# EAGLE design persephone_A_v1 (EAGLE 9.6.2)

## Sheet 1 of 2: Peak indicator
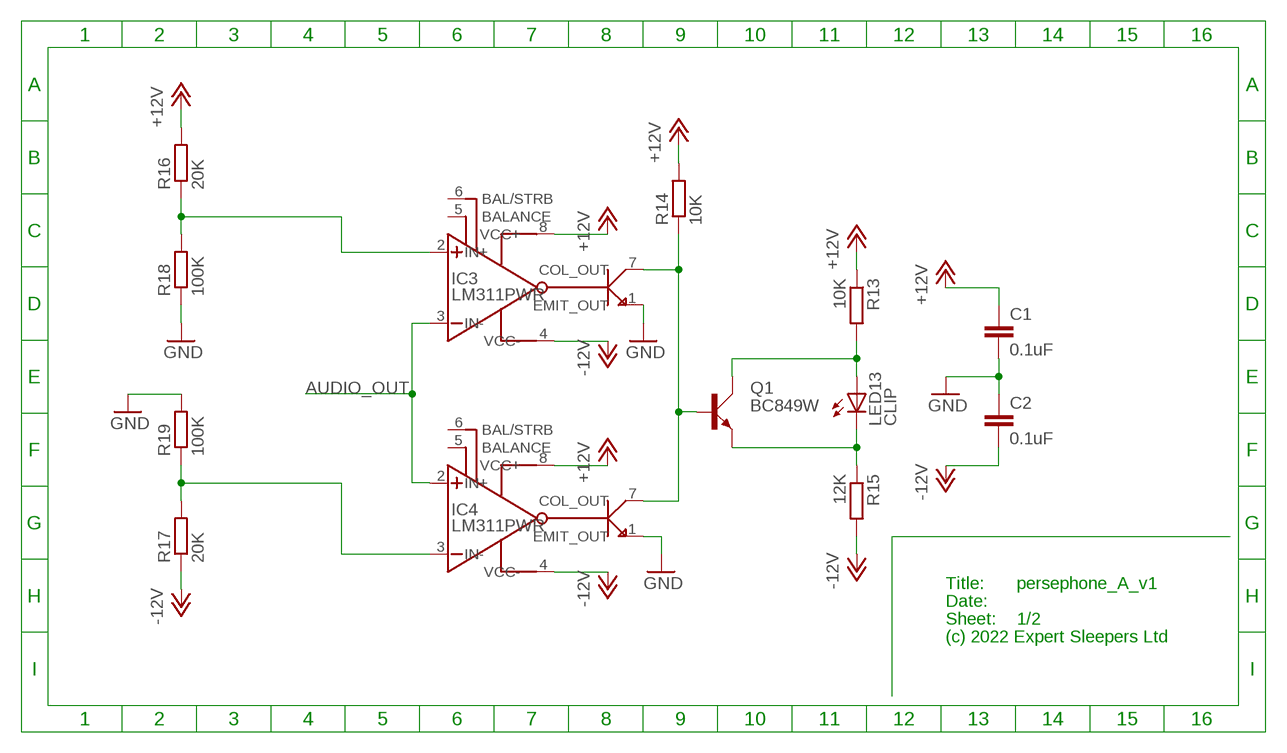
[diagram p0: schematic, sheet 1]

### Parts
C1  0.1uF  C-EUC0402  [C0402]
C2  0.1uF  C-EUC0402  [C0402]
IC3  LM311PWR  [SOP65P640X120-8N]
IC4  LM311PWR  [SOP65P640X120-8N]
LED13  CLIP  L-710A8RS/1SRD  [L-710A8RS]
Q1  BC849W  [SOT323]
R13  10K  R-EU_R0603  [R0603]
R14  10K  R-EU_R0603  [R0603]
R15  12K  R-EU_R0603  [R0603]
R16  20K  R-EU_R0603  [R0603]
R17  20K  R-EU_R0603  [R0603]
R18  100K  R-EU_R0603  [R0603]
R19  100K  R-EU_R0603  [R0603]

### Nets
+12V: C1.1 IC3.8(VCC+) IC4.8(VCC+) R13.1 R14.2 R16.2 ; also sheet 2
-12V: C2.2 IC3.4(VCC-) IC4.4(VCC-) R15.2 R17.1 ; also sheet 2
AUDIO_OUT: IC3.3(IN-) IC4.2(IN+) ; also sheet 2
GND [power]: C1.2 C2.1 IC3.1(EMIT_OUT) IC4.1(EMIT_OUT) R18.1 R19.2 ; also sheet 2
N$2: LED13.C Q1.2(E) R15.1
N$4: LED13.A Q1.3(C) R13.2
N$9: IC3.7(COL_OUT) IC4.7(COL_OUT) Q1.1(B) R14.1
N$13: IC3.2(IN+) R16.1 R18.2
N$14: IC4.3(IN-) R17.2 R19.1
Unconnected: IC3.5(BALANCE) IC3.6(BAL/STRB) IC4.5(BALANCE) IC4.6(BAL/STRB)

### Notes on the sheet
- Title:
- Date:
- Sheet:
- (c) 2022 Expert Sleepers Ltd

## Sheet 2 of 2: Audio I/O
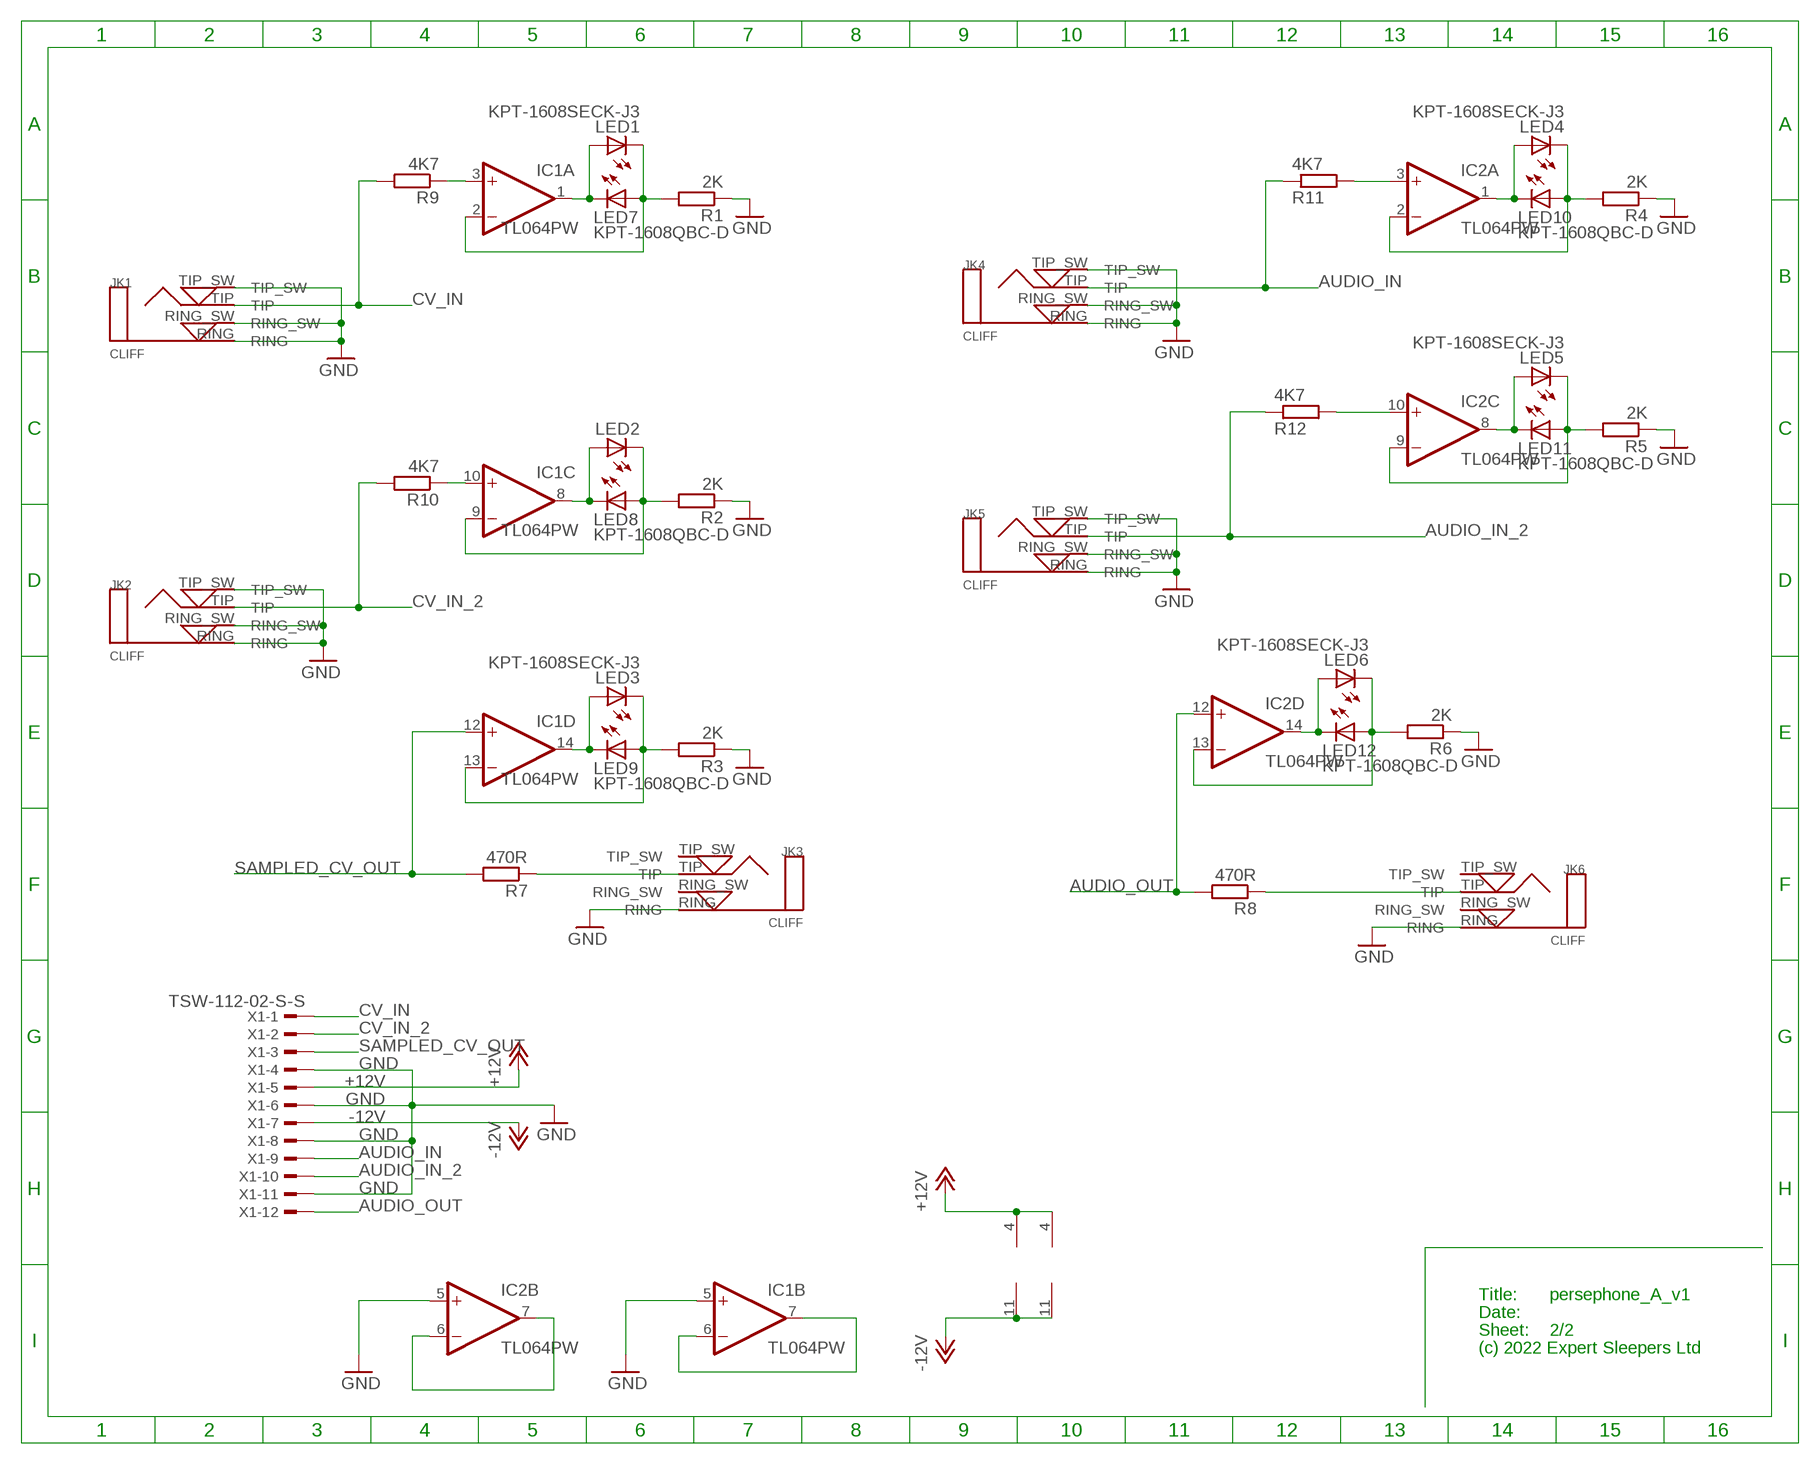
[diagram p1: schematic, sheet 2]

### Parts
IC1  TL064PW  TL074PW  [PW_R-PDSO-G14]
IC2  TL064PW  TL074PW  [PW_R-PDSO-G14]
JK1  CLIFF  CLIFF3.5MM_PCB_SW_JK  [CLIFF3.5MMPCB]
JK2  CLIFF  CLIFF3.5MM_PCB_SW_JK  [CLIFF3.5MMPCB]
JK3  CLIFF  CLIFF3.5MM_PCB_SW_JK  [CLIFF3.5MMPCB]
JK4  CLIFF  CLIFF3.5MM_PCB_SW_JK  [CLIFF3.5MMPCB]
JK5  CLIFF  CLIFF3.5MM_PCB_SW_JK  [CLIFF3.5MMPCB]
JK6  CLIFF  CLIFF3.5MM_PCB_SW_JK  [CLIFF3.5MMPCB]
LED1  KPT-1608SECK-J3  [CHIPLED_0603_LEFT]
LED2  KPT-1608SECK-J3  [CHIPLED_0603_LEFT]
LED3  KPT-1608SECK-J3  [CHIPLED_0603_LEFT]
LED4  KPT-1608SECK-J3  [CHIPLED_0603_LEFT]
LED5  KPT-1608SECK-J3  [CHIPLED_0603_LEFT]
LED6  KPT-1608SECK-J3  [CHIPLED_0603_LEFT]
LED7  KPT-1608QBC-D  [CHIPLED_0603_RIGHT]
LED8  KPT-1608QBC-D  [CHIPLED_0603_RIGHT]
LED9  KPT-1608QBC-D  [CHIPLED_0603_RIGHT]
LED10  KPT-1608QBC-D  [CHIPLED_0603_RIGHT]
LED11  KPT-1608QBC-D  [CHIPLED_0603_RIGHT]
LED12  KPT-1608QBC-D  [CHIPLED_0603_RIGHT]
R1  2K  R-EU_R1206  [R1206]
R2  2K  R-EU_R1206  [R1206]
R3  2K  R-EU_R1206  [R1206]
R4  2K  R-EU_R1206  [R1206]
R5  2K  R-EU_R1206  [R1206]
R6  2K  R-EU_R1206  [R1206]
R7  470R  R-EU_R1206  [R1206]
R8  470R  R-EU_R1206  [R1206]
R9  4K7  R-EU_R1206  [R1206]
R10  4K7  R-EU_R1206  [R1206]
R11  4K7  R-EU_R1206  [R1206]
R12  4K7  R-EU_R1206  [R1206]
X1  TSW-112-02-S-S  [TSW-112-02-S-S]

### Nets
+12V: IC1.4(P:V+) IC2.4(P:V+) X1.5 ; also sheet 1
-12V: IC1.11(P:V-) IC2.11(P:V-) X1.7 ; also sheet 1
AUDIO_IN: JK4.TIP R11.1 X1.9
AUDIO_IN_2: JK5.TIP R12.1 X1.10
AUDIO_OUT: IC2.12(D:+IN) R8.2 X1.12 ; also sheet 1
CV_IN: JK1.TIP R9.2 X1.1
CV_IN_2: JK2.TIP R10.2 X1.2
GND [power]: IC1.5(B:+IN) IC2.5(B:+IN) JK1.RING JK1.RING_SW JK1.TIP_SW JK2.RING JK2.RING_SW JK2.TIP_SW JK3.RING JK4.RING JK4.RING_SW JK4.TIP_SW JK5.RING JK5.RING_SW JK5.TIP_SW JK6.RING R1.1 R2.1 R3.1 R4.1 R5.1 R6.1 X1.4 X1.6 X1.8 X1.11 ; also sheet 1
N$6: IC2.6(B:-IN) IC2.7(B:OUT)
N$11: IC1.14(D:OUT) LED3.2(A) LED9.2(C)
N$16: IC1.10(C:+IN) R10.1
N$17: IC1.13(D:-IN) LED3.1(C) LED9.1(A) R3.2
N$19: IC1.1(A:OUT) LED1.2(A) LED7.2(C)
N$21: IC2.10(C:+IN) R12.2
N$22: IC1.2(A:-IN) LED1.1(C) LED7.1(A) R1.2
N$25: IC1.3(A:+IN) R9.1
N$29: IC1.8(C:OUT) LED2.2(A) LED8.2(C)
N$30: IC1.9(C:-IN) LED2.1(C) LED8.1(A) R2.2
N$33: IC1.6(B:-IN) IC1.7(B:OUT)
N$34: JK3.TIP R7.1
N$47: IC2.3(A:+IN) R11.2
N$62: IC2.8(C:OUT) LED5.2(A) LED11.2(C)
N$63: IC2.9(C:-IN) LED5.1(C) LED11.1(A) R5.2
N$65: IC2.14(D:OUT) LED6.2(A) LED12.2(C)
N$66: IC2.13(D:-IN) LED6.1(C) LED12.1(A) R6.2
N$71: IC2.1(A:OUT) LED4.2(A) LED10.2(C)
N$72: IC2.2(A:-IN) LED4.1(C) LED10.1(A) R4.2
N$76: JK6.TIP R8.1
SAMPLED_CV_OUT: IC1.12(D:+IN) R7.2 X1.3
Unconnected: JK3.RING_SW JK3.TIP_SW JK6.RING_SW JK6.TIP_SW

### Notes on the sheet
- Title:
- Date:
- Sheet:
- (c) 2022 Expert Sleepers Ltd

## Library data of the parts
C1 C2 = rcl:C-EU: CAPACITOR, European symbol
IC1 IC2 = digital-audio:TL074: OP AMP
IC3 IC4 = SamacSys_Parts:LM311PWR: High Speed, 30V, Differential Comparator With Strobes Source: Datasheet <http://www.ti.com/lit/ds/symlink/lm311.pdf>; ARROW_PART_NUMBER: LM311PWR; ARROW_PRICE-STOCK: https://www.arrow.com/en/products/lm311pwr/texas-instruments; DESCRIPTION: High Speed, 30V, Differential Comparator With Strobes; HEIGHT: 1.2mm; MANUFACTURER_NAME: Texas Instruments; MANUFACTURER_PART_NUMBER: LM311PWR; MOUSER_PART_NUMBER: 595-LM311PWR; MOUSER_PRICE-STOCK: https://www.mouser.co.uk/ProductDetail/Texas-Instruments/LM311PWR/?qs=YEaxc5757jOQ2Epklu87Vw%3D%3D
JK1-JK6 = cliff:CLIFF3.5MM_PCB_SW_JK: Cliff 3.5mm Mono PCB switched jack socket
LED1-LED6 = kingbright:KPT-1608SECK-J3
LED7-LED12 = kingbright:KPT-1608QBC-D
LED13 = kingbright:L-710A8RS: Kingbright L-710A8RS T-1 (3mm) RIGHT ANGLE LED INDICATOR; OC_FARNELL: 2373386
Q1 = NXP:BC849W
R1-R19 = rcl:R-EU_: RESISTOR, European symbol
X1 = con-samtec:TSW-112-02-S-S: THROUGH-HOLE .025" SQ POST HEADER Source: Samtec TSW.pdf; OC_FARNELL: unknown; OC_NEWARK: unknown

## Board
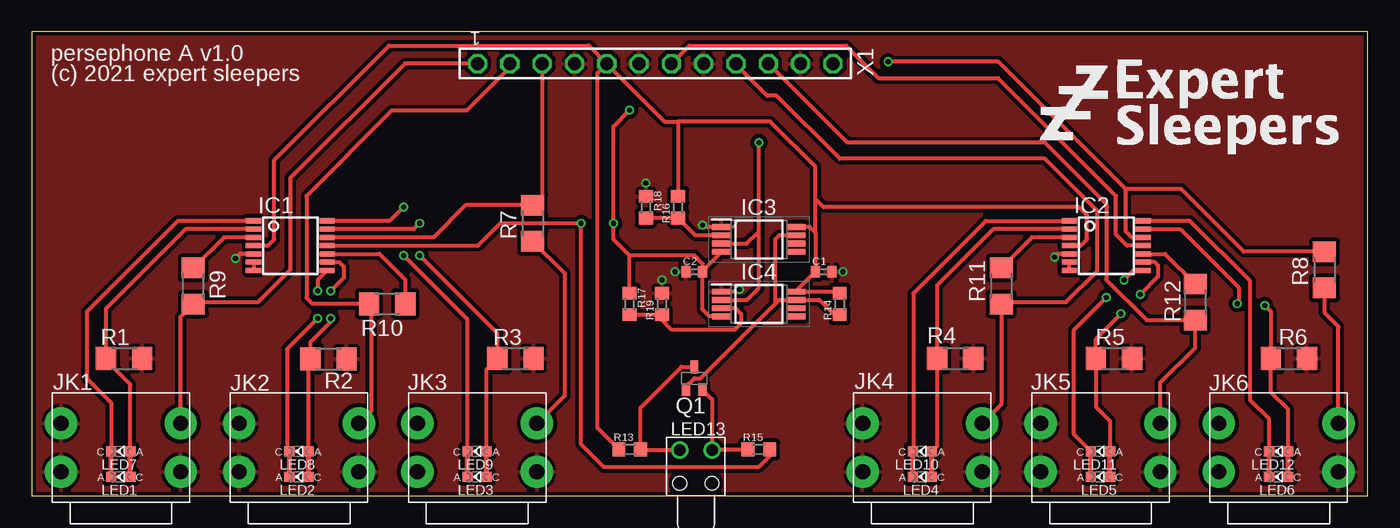
[diagram p2: board, top side]
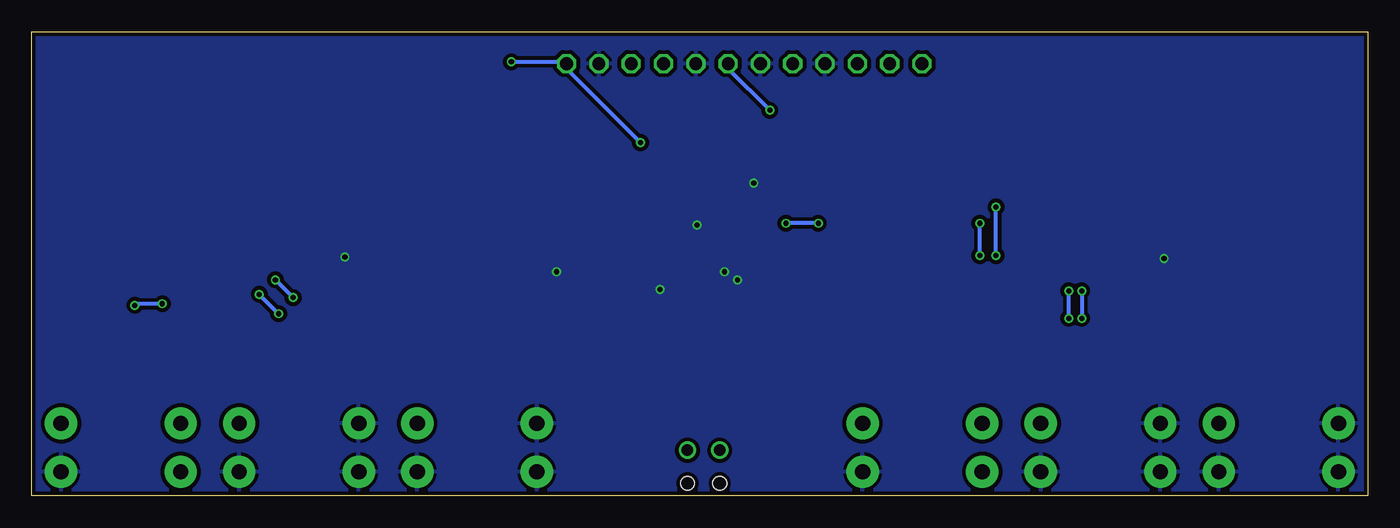
[diagram p3: board, bottom side, seen from below]

Size 105 x 36.5 mm. Coordinates in mm from the lower left corner, seen from the top.
Outline: 0,0 105,0 105,36.5 0,36.5 0,0
Copper layers (1*16): Top 0.035mm / dielectric 1.5mm / Bottom 0.035mm
Design rules "pcbtrain *": minimum track width 0.125mm, minimum drill 0.3mm, track to track 0.125mm, track to pad 0.125mm, pad to pad 0.125mm, via to via 0.125mm, smd to smd 0.125mm, copper to edge 0.25mm, drill to drill 8mil, minimum pad ring 0.15mm, minimum via ring 0.15mm, stop-mask expansion 4mil, vias tented up to drill 0mil, thermal gap 10mil

### Footprints (pad centres in the part's own frame; a part is rotated, then mirrored left to right if it is on the bottom)
C0402 = smd 0.7 x 0.9: 1 -0.65,0; 2 0.65,0
PW_R-PDSO-G14 = smd 0.4 x 1.2: 1 -1.95,-2.9; 2 -1.3,-2.9; 3 -0.65,-2.9; 4 0,-2.9; 5 0.65,-2.9; 6 1.3,-2.9; 7 1.95,-2.9; 8 1.95,2.9; 9 1.3,2.9; 10 0.65,2.9; 11 0,2.9; 12 -0.65,2.9; 13 -1.3,2.9; 14 -1.95,2.9
SOP65P640X120-8N = smd 1.475 x 0.45: 1 -2.938,0.975; 2 -2.938,0.325; 3 -2.938,-0.325; 4 -2.938,-0.975; 5 2.938,-0.975; 6 2.938,-0.325; 7 2.938,0.325; 8 2.938,0.975
CLIFF3.5MMPCB = drill 1.2 pad 2.54: RING 4.7,-1.9; RING_SW -4.7,-1.9; TIP 4.7,1.9; TIP_SW -4.7,1.9
CHIPLED_0603_LEFT = smd 0.8 x 0.8: 1 0,-0.75; 2 0,0.75
CHIPLED_0603_RIGHT = smd 0.8 x 0.8: 1 0,-0.75; 2 0,0.75
L-710A8RS = drill 0.9: A -1.27,3.6; C 1.27,3.6 | hole 1.1: -1.27,1; 1.27,1
SOT323 = smd 0.6 x 1: 1 -0.65,-0.9; 2 0.65,-0.9; 3 0,0.9
R1206 = smd 1.6 x 1.803: 1 -1.422,0; 2 1.422,0
R0603 = smd 1 x 1.1: 1 -0.85,0; 2 0.85,0
TSW-112-02-S-S = drill 1 pad 1.5 octagon: 1 13.97,0; 2 11.43,0; 3 8.89,0; 4 6.35,0; 5 3.81,0; 6 1.27,0; 7 -1.27,0; 8 -3.81,0; 9 -6.35,0; 10 -8.89,0; 11 -11.43,0; 12 -13.97,0

### Placement (x,y rotation side)
C1  62.23,17.63 0 top
C2  52.07,17.63 0 top
IC1  20.32,19.68 270 top
IC2  84.45,19.68 270 top
IC3  57.15,20.17 0 top
IC4  57.15,15.09 0 top
JK1  7,3.8 0 top
JK2  21,3.8 0 top
JK3  35,3.8 0 top
JK4  70,3.8 0 top
JK5  84,3.8 0 top
JK6  98,3.8 0 top
LED1  7,1.5 90 top
LED2  21,1.5 90 top
LED3  35,1.5 90 top
LED4  70,1.5 90 top
LED5  84,1.5 90 top
LED6  98,1.5 90 top
LED7  7,3.5 90 top
LED8  21,3.5 90 top
LED9  35,3.5 90 top
LED10  70,3.5 90 top
LED11  84,3.5 90 top
LED12  98,3.5 90 top
LED13  52.2,0 0 top
Q1  52.07,9.25 0 top
R1  7.25,10.81 180 top
R2  23.32,10.78 180 top
R3  38.02,10.81 180 top
R4  72.58,10.81 180 top
R5  85.06,10.81 180 top
R6  98.81,10.81 180 top
R7  39.37,21.44 90 top
R8  101.6,17.78 90 top
R9  12.7,16.51 270 top
R10  27.93,15.11 180 top
R11  76.2,16.51 90 top
R12  91.44,15.24 90 top
R13  46.99,3.66 0 top
R14  63.5,15.09 90 top
R15  57.15,3.66 0 top
R16  50.8,22.71 90 top
R17  46.99,15.09 270 top
R18  48.26,22.71 270 top
R19  49.53,15.09 90 top
U$1  [ES_ZZZ_TEXT_TPLACE_1IN_600DPI]  78.28,26.45 0 top
X1  49,34 180 top

### Tracks (layer width: path | path; a pad name or v marks a point on that pad's centre or on a via)
+12V
  Top 0.305: R14.2 63.38,16.07 IC4.8 60.09,16.14 C1.1 61.58,20.69 | IC3.8 61.13,21.14 61.58,20.69 | 50.8,29.44 R16.2 | R13.1 44.45,5.35 44.45,33.26 X1.5 | 61.58,20.69 61.58,23.36 | 61.58,23.36 61.58,25.9 58.04,29.44 50.8,29.44 | IC1.4 18.57,19.68 19.05,20.17 19.05,26.39 28.07,35.41 43.78,35.41 X1.5 | IC2.4 82.45,19.68 82.93,20.17 82.93,22.07 82.3,22.71 62.23,22.71 61.58,23.36 | 50.8,29.44 49.75,29.44 X1.5
-12V  (via drill 0.4)
  Top 0.305: 52.72,17.7 C2.2 52.72,14.65 53.25,14.12 IC4.4 | 52.72,17.7 IC3.4 | R17.1 46.99,18.9 | 52.72,17.7 52.72,18.25 52.07,18.9 46.99,18.9 | 46.99,18.9 45.72,20.17 v45.72,21.44 45.72,29.06 v46.99,30.33 | IC1.11 35.08,19.68 36.83,21.44 v43.18,21.44 43.18,4.04 44.96,2.26 57.11,2.26 58,3.15 R15.2 | IC2.11 86.08,19.68 85.22,20.55 85.22,23.6 75.95,32.87 66.55,32.87 64.01,35.41 51.68,35.41 X1.7
  Bottom 0.305: v46.99,30.33 50.27,33.61 X1.7 | v43.18,21.44 v45.72,21.44
AUDIO_IN
  Top 0.305: JK4.TIP 76.2,7.2 R11.1 76.35,15.24 81.28,15.24 83.69,17.65 83.69,22.46 79.63,26.52 63.5,26.52 58.55,31.47 57.78,31.47 55.35,33.91 X1.9
AUDIO_IN_2
  Top 0.305: JK5.TIP 88.7,8.91 91.44,11.65 R12.1 87.63,13.82 84.45,17 84.45,22.96 79.63,27.79 64.1,27.79 X1.10
AUDIO_OUT  (via drill 0.4)
  Top 0.305: IC2.12 86.47,20.34 85.96,20.84 85.96,24.12 85.99,24.12 | R8.2 95.25,19.2 90.33,24.12 85.99,24.12 | IC4.2 56.2,15.41 57.15,16.36 57.15,20.8 | IC3.3 56.19,19.84 57.15,20.8 | 57.15,20.8 v57.15,27.79 | v67.31,34.14 75.97,34.14 85.99,24.12
  Bottom 0.305: v67.31,34.14 63.11,34.14 X1.12 62.97,33.61 v57.15,27.79
CV_IN
  Top 0.305: JK1.TIP 11.7,14.09 R9.2 12.85,15.24 17.78,15.24 20.32,17.78 20.32,25 29.32,34 X1.1
CV_IN_2
  Top 0.305: JK2.TIP 26.67,6.67 26.67,14.95 R10.2 22.06,15.11 21.59,15.58 21.59,23.6 28.3,30.31 34.19,30.31 37.57,33.69 X1.2
GND  (via drill 0.4)
  Top 0.305: IC2.5 80.63,19.04 v80.39,18.8 | IC1.5 16.37,19.04 v16,18.67 | IC3.1 52.87,21.14 v52.7,21.31 | IC4.1 55.46,16.07 v55.63,16.23
  other vias: 63.75,17.63 50.55,17.63 49.53,17 48.26,24.61
  pour Top (isolate 0.305): 0,0 105,0 105,36.5 0,36.5
  pour Bottom (isolate 0.305): 0,0 105,0 105,36.5 0,36.5
N$2
  Top 0.305: R15.1 53.53,3.66 LED13.C 53.47,7.6 Q1.2
N$4
  Top 0.305: LED13.A 47.9,3.6 R13.2 47.84,6.92 51.06,10.15 Q1.3
N$6
  Top 0.305: IC2.7 IC2.6
N$9
  Top 0.305: Q1.1 51.42,8.6 52.07,9.25 52.58,9.25 58.42,15.09 | R14.1 63.08,14.24 61.91,15.41 IC4.7 58.74,15.41 58.42,15.09 | IC3.7 58.74,20.5 58.42,20.17 58.42,15.09
N$11  (via drill 0.4)
  Top 0.305: LED9.2 34.25,13.86 v29.21,18.9 | v29.21,22.71 28.14,21.64 IC1.14
  Top 0.406: LED3.2 LED9.2
  Bottom 0.305: v29.21,18.9 v29.21,22.71
N$13
  Top 0.305: IC3.2 52.16,20.5 R16.1 R18.2
N$14
  Top 0.305: R17.2 R19.1 49.53,13.82 50.29,13.06 55.24,13.06 55.75,13.57 55.75,14.33 55.32,14.77 IC4.3
N$16
  Top 0.305: R10.1 29.35,17 27.32,19.04 IC1.10
N$17  (via drill 0.4)
  Top 0.305: LED9.1 35.75,9.96 R3.2 36.6,12.78 v30.48,18.9 | v30.48,21.44 30.02,20.98 IC1.13
  Top 0.406: LED3.1 LED9.1
  Bottom 0.305: v30.48,18.9 v30.48,21.44
N$19
  Top 0.305: IC1.1 11.47,21.64 4.32,14.48 4.32,9.24 6.25,7.31 LED7.2
  Top 0.406: LED1.2 LED7.2
N$21
  Top 0.305: IC2.10 89.07,19.04 R12.2
N$22
  Top 0.305: LED7.1 7.75,8.76 6.35,10.16 | IC1.2 12.1,20.98 5.83,14.72 R1.2
  Top 0.406: LED1.1 LED7.1 | 6.35,10.16 6.35,10.29 R1.2
N$25
  Top 0.305: IC1.3 15.1,20.34 R9.1
N$29  (via drill 0.4)
  Top 0.305: IC1.8 22.48,16.99 v22.48,16.13 | LED8.2 20.05,3.7 20.05,11.54 v22.48,13.97
  Top 0.406: LED2.2 LED8.2
  Bottom 0.305: v22.48,16.13 v22.48,13.97
N$30  (via drill 0.4)
  Top 0.305: v23.5,16.13 24.51,17.14 24.51,18.03 24.16,18.39 IC1.9 | LED8.1 21.75,10.63 R2.2 21.9,12.1 23.5,13.69 v23.5,13.97
  Top 0.406: LED2.1 LED8.1
  Bottom 0.305: v23.5,13.97 v23.5,16.13
N$33
  Top 0.305: IC1.6 IC1.7
N$34
  Top 0.305: JK3.TIP 41.91,7.91 41.91,17.48 R7.1
N$47
  Top 0.305: IC2.3 78.6,20.34 R11.2
N$62  (via drill 0.4)
  Top 0.305: LED11.2 81.92,4.83 81.92,13.06 v84.45,15.6 | IC2.8 86.59,17.73 v85.85,17
  Top 0.406: LED5.2 LED11.2
  Bottom 0.305: v84.45,15.6 v85.85,17
N$63  (via drill 0.4)
  Top 0.305: LED11.1 84.75,5.89 83.64,7 R5.2 83.64,12.33 85.6,14.3 v85.6,14.33 | IC2.9 88.27,18.39 88.52,18.14 88.52,17.25 v87.12,15.85
  Top 0.406: LED5.1 LED11.1
  Bottom 0.305: v85.6,14.33 v87.12,15.85
N$65
  Top 0.305: LED12.2 97.25,6.04 95.76,7.53 95.76,16.89 91.01,21.64 IC2.14
  Top 0.406: LED6.2 LED12.2
N$66  (via drill 0.4)
  Top 0.305: IC2.13 90.27,20.98 94.87,16.38 94.87,15.24 v94.74,15.11 | v96.9,14.99 97.38,14.5 R6.2 97.38,8.15 98.75,6.79 LED12.1
  Top 0.406: LED6.1 LED12.1
  Bottom 0.305: v94.74,15.11 96.77,15.11 v96.9,14.99
N$71
  Top 0.305: LED10.2 69.28,3.53 69.28,15.94 74.97,21.64 IC2.1
  Top 0.406: LED4.2 LED10.2
N$72
  Top 0.305: IC2.2 75.59,20.98 71.16,16.55 R4.2 71.16,3.91 LED10.1
  Top 0.406: LED4.1 LED10.1
N$76
  Top 0.305: JK6.TIP 102.7,13.32 101.6,14.42 R8.1
SAMPLED_CV_OUT
  Top 0.305: IC1.12 31.58,20.34 34.11,22.86 R7.2 40.11,23.6 X1.3

### Text on the board
tPlace: persephone A v1.0 | (c) 2021 expert sleepers